# Altium schematic sheet STB_Camera.SchDoc: STB Light Board - Camera
size A3; Author: mayerph; DrawnBy: mayerph; Organization: PBL; Revision: A; SheetNumber: 12; SheetTotal: 21
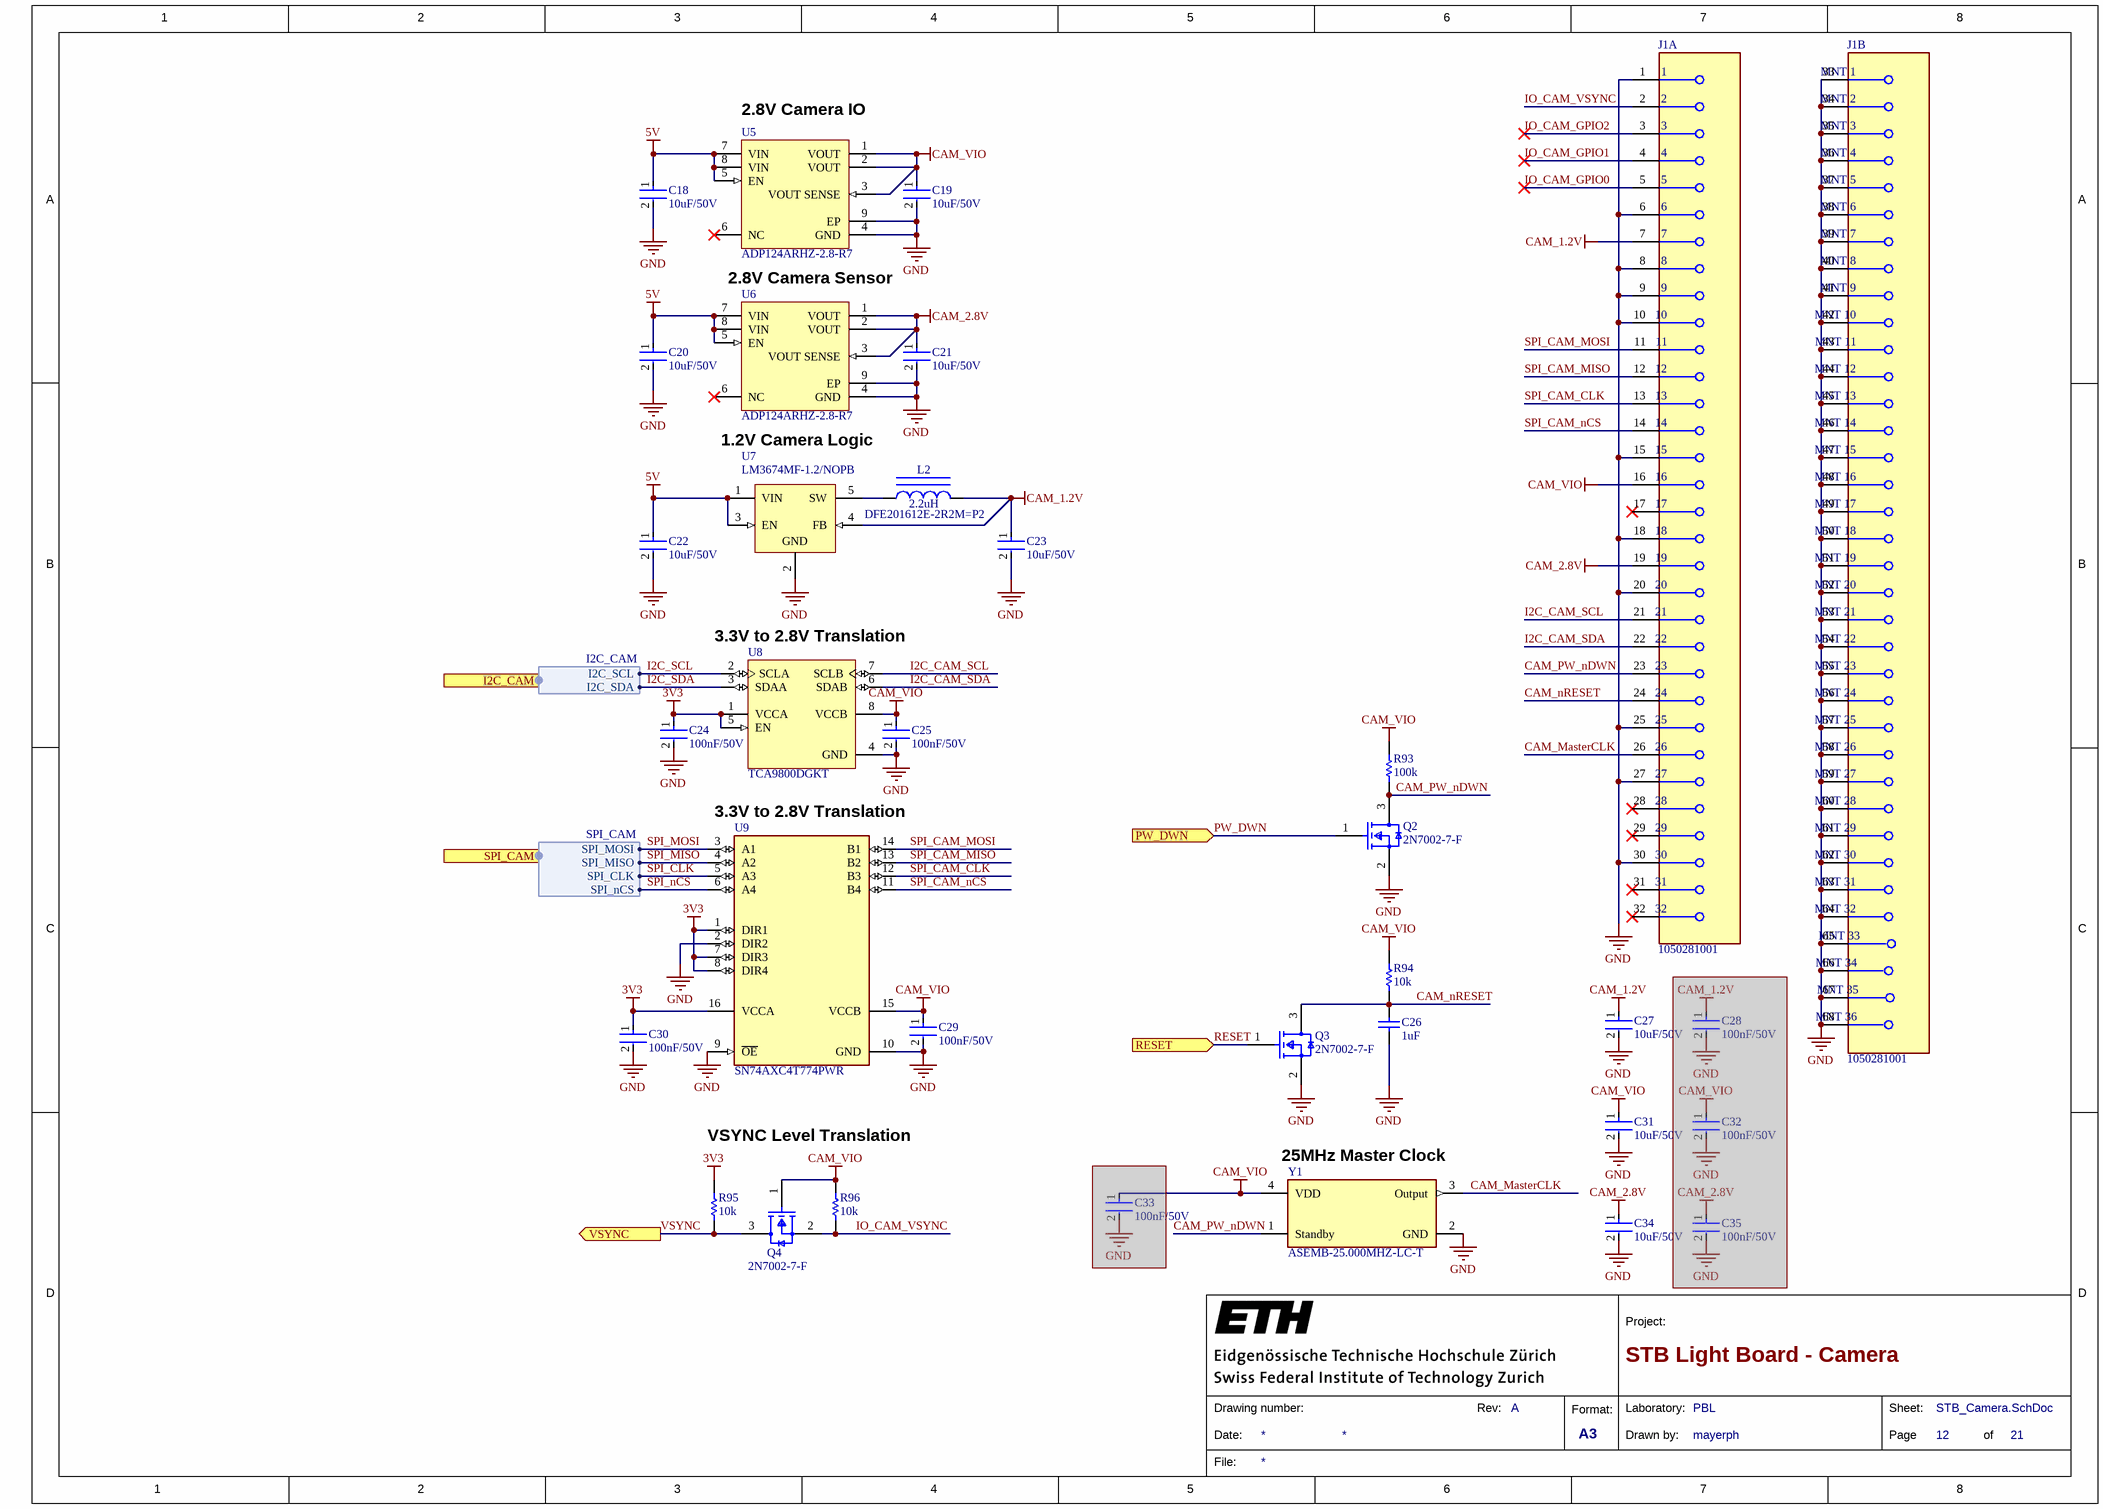
[diagram p0: STB_Camera.SchDoc]

## Parts
C18  10uF/50V  [FP-CL31B106KBHNNNE-MFG]
C19  10uF/50V  [FP-CL31B106KBHNNNE-MFG]
C20  10uF/50V  [FP-CL31B106KBHNNNE-MFG]
C21  10uF/50V  [FP-CL31B106KBHNNNE-MFG]
C22  10uF/50V  [FP-CL31B106KBHNNNE-MFG]
C23  10uF/50V  [FP-CL31B106KBHNNNE-MFG]
C24  100nF/50V  [FP-CL10-0_1-MFG]
C25  100nF/50V  [FP-CL10-0_1-MFG]
C26  1uF  [CAPC1608X90X35LL15T15]
C27  10uF/50V  [FP-CL31B106KBHNNNE-MFG]
C28  100nF/50V  [FP-CL10-0_1-MFG]  (masked out: inside a compile mask, not in the netlist)
C29  100nF/50V  [FP-CL10-0_1-MFG]
C30  100nF/50V  [FP-CL10-0_1-MFG]
C31  10uF/50V  [FP-CL31B106KBHNNNE-MFG]
C32  100nF/50V  [FP-CL10-0_1-MFG]  (masked out: inside a compile mask, not in the netlist)
C33  100nF/50V  [FP-CL10-0_1-MFG]  (masked out: inside a compile mask, not in the netlist)
C34  10uF/50V  [FP-CL31B106KBHNNNE-MFG]
C35  100nF/50V  [FP-CL10-0_1-MFG]  (masked out: inside a compile mask, not in the netlist)
J1  1050281001  [FP-1050281001-MFG]  (parts A,B of 2)
L2  DFE201612E-2R2M=P2  value 2.2uH  [INDC2016X10L]
Q2  2N7002-7-F  [FP-SOT23-MFG]
Q3  2N7002-7-F  [FP-SOT23-MFG]
Q4  2N7002-7-F  [FP-SOT23-MFG]
R93  100k  [RESC1005X40X25LL05T10]
R94  10k  [RESC1005X40X25LL05T05]
R95  10k  [RESC1005X40X25LL05T05]
R96  10k  [RESC1005X40X25LL05T05]
U5  ADP124ARHZ-2.8-R7  [ADI-RH-8-1_N]
U6  ADP124ARHZ-2.8-R7  [ADI-RH-8-1_N]
U7  LM3674MF-1.2/NOPB  [DBV0005A_N]
U8  TCA9800DGKT  [DGK0008A_L]
U9  SN74AXC4T774PWR  [FP-PW0016A-IPC_B]
Y1  ASEMB-25.000MHZ-LC-T  [FP-ASEMB-MFG]

## Ports
I2C_CAM (harness I2C_CAM, see STB_LightBoard[5A]), PW_DWN (in, see STB_LightBoard[5A]), RESET (in, see STB_LightBoard[5A]), SPI_CAM (harness SPI_CAM, see STB_LightBoard[5A]), VSYNC (out, see STB_LightBoard[5A])

## Harnesses
I2C_CAM: I2C_SDA, I2C_SCL
SPI_CAM: SPI_MISO, SPI_MOSI, SPI_CLK, SPI_nCS

## Nets
3V3: C24.1 C30.1 R95.1 U8.1(VCCA) U8.5(EN) U9.1(DIR1) U9.7(DIR3) U9.8(DIR4) U9.16(VCCA)
5V: C18.1 C20.1 C22.1 U5.5(EN) U5.7(VIN) U5.8(VIN) U6.5(EN) U6.7(VIN) U6.8(VIN) U7.1(VIN) U7.3(EN)
CAM_1.2V: C23.1 C27.1 J1.7 L2.2 U7.4(FB)
CAM_2.8V: C21.1 C34.1 J1.19 U6.1(VOUT) U6.2(VOUT) U6.3(VOUT_SENSE)
CAM_VIO: C19.1 C25.1 C29.1 C31.1 J1.16 Q4.1(G) R93.1 R94.1 R96.1 U5.1(VOUT) U5.2(VOUT) U5.3(VOUT_SENSE) U8.8(VCCB) U9.15(VCCB) Y1.4(VDD)
GND: C18.2 C19.2 C20.2 C21.2 C22.2 C23.2 C24.2 C25.2 C26.1 C27.2 C29.2 C30.2 C31.2 C34.2 J1.1 J1.6 J1.8 J1.9 J1.10 J1.15 J1.18 J1.20 J1.25 J1.27 J1.30 J1.33(MNT_1) J1.34(MNT_2) J1.35(MNT_3) J1.36(MNT_4) J1.37(MNT_5) J1.38(MNT_6) J1.39(MNT_7) J1.40(MNT_8) J1.41(MNT_9) J1.42(MNT_10) J1.43(MNT_11) J1.44(MNT_12) J1.45(MNT_13) J1.46(MNT_14) J1.47(MNT_15) J1.48(MNT_16) J1.49(MNT_17) J1.50(MNT_18) J1.51(MNT_19) J1.52(MNT_20) J1.53(MNT_21) J1.54(MNT_22) J1.55(MNT_23) J1.56(MNT_24) J1.57(MNT_25) J1.58(MNT_26) J1.59(MNT_27) J1.60(MNT_28) J1.61(MNT_29) J1.62(MNT_30) J1.63(MNT_31) J1.64(MNT_32) J1.65(MNT_33) J1.66(MNT_34) J1.67(MNT_35) J1.68(MNT_36) Q2.2(S) Q3.2(S) U5.4(GND) U5.9(EP) U6.4(GND) U6.9(EP) U7.2(GND) U8.4(GND) U9.2(DIR2) U9.9(~{OE}) U9.10(GND) Y1.2(GND)
CAM_MasterCLK: J1.26 Y1.3(Output)
CAM_nRESET: C26.2 J1.24 Q3.3(D) R94.2
CAM_PW_nDWN: J1.23 Q2.3(D) R93.2 Y1.1(Standby)
I2C_CAM_SCL: J1.21 U8.7(SCLB)
I2C_CAM_SDA: J1.22 U8.6(SDAB)
I2C_SCL: U8.2(SCLA) ; port I2C_CAM.I2C_SCL
I2C_SDA: U8.3(SDAA) ; port I2C_CAM.I2C_SDA
IO_CAM_GPIO0: J1.5
IO_CAM_GPIO1: J1.4
IO_CAM_GPIO2: J1.3
IO_CAM_VSYNC: J1.2 Q4.2(S) R96.2
PW_DWN: Q2.1(G) ; port PW_DWN
RESET: Q3.1(G) ; port RESET
SPI_CAM_CLK: J1.13 U9.12(B3)
SPI_CAM_MISO: J1.12 U9.13(B2)
SPI_CAM_MOSI: J1.11 U9.14(B1)
SPI_CAM_nCS: J1.14 U9.11(B4)
SPI_CLK: U9.5(A3) ; port SPI_CAM.SPI_CLK
SPI_MISO: U9.4(A2) ; port SPI_CAM.SPI_MISO
SPI_MOSI: U9.3(A1) ; port SPI_CAM.SPI_MOSI
SPI_nCS: U9.6(A4) ; port SPI_CAM.SPI_nCS
VSYNC: Q4.3(D) R95.2 ; port VSYNC
NetL2_1: L2.1 U7.5(SW)

Not connected (* = marked no-connect by the designer): J1 17* 28* 29* 31* 32*; U5 6(NC)*; U6 6(NC)*

## Notes on the sheet
- (near U5) 2.8V Camera IO
- 2.8V Camera Sensor
- 1.2V Camera Logic
- (near U8) 3.3V to 2.8V Translation
- (near U9) 3.3V to 2.8V Translation
- VSYNC Level Translation
- (near Y1) 25MHz Master Clock
- 1
- 2
- 3
- 4
- 5
- 6
- 7
- 8
- A
- B
- C
- D
- Project:
- Date:
- Drawing number:
- Rev:
- Format:
- A3
- Drawn by:
- Laboratory:
- Page
- Sheet:
- of
- File:

## Library data of the parts
C18-C23 C27 C31 C34 = CMP-2000-07530-2: CAP CER 10UF 50V X7R 1206; Manufacturer: Samsung; Manufacturer Part Number: CL31B106KBHNNNE; Tolerance: 10%; Material: Ceramic; Temperature Coefficient: 15%; Multilayer: Yes; Temperature Characteristic: X7R; Digikey Description: CAP CER 10UF 50V X7R 1206; Device Class L1: Passive Components; Value: 10uF; Lead Free: Yes; Device Class L3: Ceramic Capacitors; Octopart: https://octopart.com/cl31b106kbhnnne-samsung-30507377; ComponentLink2URL: http://www.samsungsem.com/global/front/downloadcms.do?path=%2F%2Fglobal%2F%2Fsupport%2F%2Fproduct-search%2F%2Fmlcc%2F%2F__icsFiles%2F%2Fafieldfile%2F%2F2019%2F%2F06%2F%2F18&fileName=CL31B106KBHNNNE-19.pdf; Voltage Rating: 50V; Temperature Range Low: -55°C; RoHS: TRUE; Temperature: -55°C to +125°C; Category: Cap; ComponentLink2Description: Datasheet; Automotive: No; Device Class L2: Capacitors; Capacitance: 10uF; Height: 1.8mm; Temperature Range High: +125°C; Package: CL31B106KBHNNNE; Supplier 1: Digi-Key; Supplier Part Number 1: 1276-6767-6-ND; Stock 1: 1900998; Pricing 1: 1=0.33000, 10=0.22700, 50=0.15920, 100=0.13650, 500=0.10236, 1000=0.08643 (USD); Mount: Surface Mount; Number of Pins: 2; Dielectric Material: Ceramic; Terminal Finish: Nickel; Size Code: 1206; Package Shape: Rectangular; Min Operating Temperature: -55°C; Max Operating Temperature: 125°C; Capacitor Type: Ceramic; Negative Tolerance: 10%; Positive Tolerance: 10%; Rated DC Voltage (URdc): 50V; Termination: Wraparound; Package Style: SMTMeter; Packaging: Tape and Reel; JESD-609 Code: e3; Temperature Characteristics Code: X7R; Length: 3.2mm; Width: 1.6mm; REACH SVHC: Yes; RoHS Compliant: Yes; ComponentLink1URL: https://datasheet.ciiva.com:443/pdfs/VipMasterIC/IC/SEMS/SEMS-S-A0008524842/SEMS-S-A0008524770-1.pdf?src-supplier=IHS+Markit; ComponentLink1Description: https://datasheet.ciiva.com:443/pdfs/VipMasterIC/IC/SEMS/SEMS-S-A0008524842/SEMS-S-A0008524770-1.pdf?src-supplier=IHS+Markit; ComponentLink3URL: http://www.samsungsem.com/kr/support/product-search/mlcc/CL31B106KBHNNNE.jsp?src-supplier=Digi-Key; ComponentLink3Description: http://www.samsungsem.com/kr/support/product-search/mlcc/CL31B106KBHNNNE.jsp?src-supplier=Digi-Key
C24 C25 C28-C30 C32 C33 C35 = CMP-13271-000011-1: CAP CER 0.1UF 50V X7R 0603; Manufacturer: Samsung Electro-Mechanics America, Inc; Manufacturer Part Number: CL10B104JB8NNNC; Value: 100nF; Material: Ceramic; Temperature Coefficient: 15%; Tolerance: 5%; Multilayer: Yes; Ipc Land Pattern Name: CAPC16080X80; Device Class L1: Passive Components; Digikey Description: CAP CER 0.1UF 50V X7R 0603; Voltage Rating: 50V; Height: 0.9mm; ComponentLink2Description: Datasheet; Device Class L2: Capacitors; ComponentLink2URL: http://www.samsungsem.com/kr/support/product-search/mlcc/__icsFiles/afieldfile/2019/06/18/CL10B104JB8NNNC-19.pdf; Temperature Characteristic: X7R; Temperature Range High: +125°C; Lead Free: Yes; Temperature Range Low: -55°C; Category: Cap; Package: CL10-0.1; Temperature: -55°C to +125°C; Octopart: https://octopart.com/cl10b104jb8nnnc-samsung-9302151; Device Class L3: Ceramic Capacitors; RoHS: TRUE; Automotive: No; Capacitance: 100nF; Supplier 1: Digi-Key; Supplier Part Number 1: 1276-1033-1-ND; Stock 1: 1084419; Pricing 1: 1=0.10000, 10=0.03900, 50=0.02120, 100=0.01740, 500=0.01240, 1000=0.00975 (USD); Mount: Surface Mount; Number of Pins: 2; Dielectric Material: Ceramic; Package Shape: Rectangular; Size Code: 0603; Terminal Finish: Nickel; Min Operating Temperature: -55°C; Max Operating Temperature: 125°C; JESD-609 Code: e3; Capacitor Type: Ceramic; Negative Tolerance: 5%; Package Style: SMTMeter; Packaging: Tape and Reel; Positive Tolerance: 5%; Rated DC Voltage (URdc): 50V; Temperature Characteristics Code: X7R; Termination: Wraparound; Length: 1.6mm; Width: 0.8mm; REACH SVHC: Yes; RoHS Compliant: Yes; ComponentLink1URL: https://datasheet.ciiva.com:443/pdfs/VipMasterIC/IC/SEMS/SEMS-S-A0008384515/SEMS-S-A0008873313-1.pdf?src-supplier=IHS+Markit; ComponentLink1Description: https://datasheet.ciiva.com:443/pdfs/VipMasterIC/IC/SEMS/SEMS-S-A0008384515/SEMS-S-A0008873313-1.pdf?src-supplier=IHS+Markit; ComponentLink3URL: https://datasheet.ciiva.com/25793/cl10b104jb8nnnc-25793394.pdf?src-supplier=Digi-Key; ComponentLink3Description: https://datasheet.ciiva.com/25793/cl10b104jb8nnnc-25793394.pdf?src-supplier=Digi-Key; ComponentLink4URL: https://datasheet.ciiva.com/16498/cl10b104jb8nnnc-16498485.pdf?src-supplier=Future+Electronics; ComponentLink4Description: https://datasheet.ciiva.com/16498/cl10b104jb8nnnc-16498485.pdf?src-supplier=Future+Electronics; ComponentLink5URL: https://datasheet.ciiva.com/26838/getdatasheetpartid-359321-26838402.pdf?src-supplier=Verical; ComponentLink5Description: https://datasheet.ciiva.com/26838/getdatasheetpartid-359321-26838402.pdf?src-supplier=Verical; ComponentLink6URL: https://datasheet.ciiva.com/29199/456613-da-01-en-vs-kondensator-0603-29199008.pdf?src-supplier=Conrad; ComponentLink6Description: https://datasheet.ciiva.com/29199/456613-da-01-en-vs-kondensator-0603-29199008.pdf?src-supplier=Conrad
C26 = CMP-2006-02298-2: Manufacturer: Kemet; Part Number: C0603C105K4RACTU; Dielectric Material: Ceramic; Multilayer: Yes; Negative Tolerance: 10%; Rated DC Voltage (URdc): 16V; Temperature Characteristics Code: X7R; Supplier 1: Digi-Key; Supplier Part Number 1: 399-C0603C105K4RAC7867DKR-ND; Manufacturer Part Number: C0603C105K4RACTU; RoHS: Yes; Category: Ceramic Capacitors; Stock 1: 1549593; Pricing 1: 1=0.10000, 10=0.07700, 50=0.04180, 100=0.03410, 500=0.02440, 1000=0.01916 (USD); Mount: Surface Mount; Number of Pins: 2; Package Shape: Rectangular; Size Code: 0603; Terminal Finish: Nickel; Min Operating Temperature: -55°C; Max Operating Temperature: 125°C; Value: 1uF; Capacitor Type: Ceramic; Packaging: Tape and Reel; Positive Tolerance: 10%; Termination: Wraparound; JESD-609 Code: e3; Package Style: SMTMeter; Length: 1.6mm; Width: 0.8mm; Height: 0.8mm; REACH SVHC: Yes; RoHS Compliant: Yes; ComponentLink1URL: https://datasheet.ciiva.com:443/pdfs/VipMasterIC/IC/KEME/KEME-S-A0008991654/KEME-S-A0008991654-1.pdf?src-supplier=IHS+Markit; ComponentLink1Description: https://datasheet.ciiva.com:443/pdfs/VipMasterIC/IC/KEME/KEME-S-A0008991654/KEME-S-A0008991654-1.pdf?src-supplier=IHS+Markit
J1 = CMP-04777-000001-1: CONN CAM SOCKET 32POS GOLD; Manufacturer: Molex; Voltage Rating: 50V; Pitch: 0.9mm; Conn Orientation: Top View; Conn Gender: Female; Is Female: yes; Number Of Contacts: 32; Current Rating: 0.5A; Temperature Range High: +85°C; Lead Free: Yes; Digikey Description: CONN CAM SOCKET 32POS GOLD; Octopart: https://octopart.com/105028-1001-molex-19914268; Device Class L2: IC and Component Sockets; Device Class L3: unset; Temperature Range Low: -55°C; Manufacturer Part Number: 1050281001; Height: 4.35mm; Automotive: No; Temperature: -55°C to +85°C; Device Class L1: Connectors; Category: Conn; ComponentLink2Description: Datasheet; ComponentLink2URL: https://www.molex.com/pdm_docs/sd/1050281001_sd.pdf; Package: 0; Contact Material: Gold; RoHS: TRUE
L2 = CMP-01651-1: 2.2µH Shielded Wirewound Inductor 1.8A 116mOhm Max 0806 (2016 Metric); Manufacturer: Murata Electronics; Inductance: 2,2µH; Current Rating (Amps): 1,8A; Tolerance: ±20%; Material - Core: Metal; Current - Saturation: 2.4A; Inductance Frequency - Test: 1MHz; DC Resistance (DCR): 116mOhm Max; Ratings: -; Series: DFE201612E; Operating Temperature: -40°C ~ 125°C; Features: -; Package / Case: 0806 (2016 Metric); Q @ Freq: -; Packaging: Tape & Reel (TR); Mounting Type: Surface Mount; Frequency - Self Resonant: -; Part Status: Active; Shielding: Shielded; Type: Wirewound; Supplier Device Package: 0806; Manufacturer Part Number: DFE201612E-2R2M=P2
Q2-Q4 = CMP-2000-04929-2: MOSFET N-CH 60V 115MA SOT23-3; Manufacturer: Diodes; Turn-On Delay Time: 7ns; Turn-Off Delay Time: 11ns; Drain to Source Resistance: 7.5R; Rise Time: 3ns; Drain to Source Breakdown Voltage: 70V; Input Capacitance: 50pF; Number of Elements: 1; Power Dissipation: 540mW; Max Power Dissipation: 300mW; Fall Time: 5.6ns; Gate to Source Voltage (Vgs): 20V; Threshold Voltage: 2.5V; Element Configuration: Single; Package Body Material: Plastic; Transistor Element Material: SILICON; Polarity/Channel Type: N-CHANNEL; Drain-source On Resistance-Max: 13.5R; FET Technology: METAL-OXIDE SEMICONDUCTOR; Operating Mode: ENHANCEMENT MODE; Transistor Application: SWITCHING; Feedback Cap-Max (Crss): 5pF; Time @ Peak Reflow Temperature-Max (s): 40s; Qualification Status: Not Qualified; Termination: SMD/SMT; Weight: 0.000282oz; Radiation Hardening: No; Max Operating Temperature: 150°C; On-State Resistance: 7.5R; Mount: Surface Mount; Current Rating: 115mA; Contact Plating: Tin; Lead Free: Lead Free; Min Operating Temperature: -55°C; Number of Pins: 3; REACH SVHC: No SVHC; Drain to Source Voltage (Vdss): 60V; Width: 1.3mm; Package Quantity: 3000; Length: 2.9mm; Case/Package: SOT-23; Number of Channels: 1; Dual Supply Voltage: 60V; Packaging: Tape and Reel; Height: 1mm; Voltage Rating (DC): 60V; Nominal Vgs: 2.5V; Continuous Drain Current (ID): 115mA; Voltage: 60V; Rds On Max: 7.5R; Supplier 1: Digi-Key; Supplier Part Number 1: 2N7002-FDIDKR-ND; Manufacturer Part Number: 2N7002-7-F; RoHS: Yes; Category: MOSFETs; Stock 1: 2221303; Pricing 1: 1=0.21000, 10=0.19500, 100=0.10620, 500=0.06534, 1000=0.04455 (USD); Package Shape: Rectangular; Terminal Finish: Tin; Moisture Sensitivity Level: 1; Drain Current-Max (Abs) (ID): 115mA; Drain Current-Max (ID): 115mA; DS Breakdown Voltage-Min: 60V; JESD-30 Code: R-PDSO-G3; Package Style: SMALL OUTLINEMeter; Power Dissipation-Max (Abs): 300mW; Surface Mount: Yes; Terminal Form: Gull Wing; Terminal Position: DUAL; JESD-609 Code: e3; Peak Reflow Temperature (Cel): 260°C; Reach SVHC Compliant: Yes; RoHS Compliant: Yes; ComponentLink1URL: https://datasheet.ciiva.com:443/pdfs/VipMasterIC/IC/DIOD/DIOD-S-A0009689736/DIOD-S-A0009691859-1.pdf?src-supplier=IHS+Markit; ComponentLink1Description: https://datasheet.ciiva.com:443/pdfs/VipMasterIC/IC/DIOD/DIOD-S-A0009689736/DIOD-S-A0009691859-1.pdf?src-supplier=IHS+Markit
R93 = CMP-2002-07343-1: Part Number: RC0402FR-07100KL; Manufacturer: Yageo / Phycomp; Tolerance: 1%; Rated Power Dissipation (P): 62.5mW; Rated Temperature: 70°C; Value: 100 kOhm; Temperature Coefficient: 100ppm/°C; Working Voltage: 50V; Additional Feature: LASER TRIMMABLE; Package Height: 0.35mm; Package Length: 1mm; Package Width: 0.5mm; Supplier 1: Digi-Key; Supplier Part Number 1: 311-100KLRDKR-ND; Manufacturer Part Number: RC0402FR-07100KL; RoHS: Yes; Category: Chip SMD Resistors; Stock 1: 43269933; Pricing 1: 1=0.10000, 10=0.01500, 100=0.00600, 1000=0.00267, 2500=0.00232, 5000=0.00192 (USD); Mount: Surface Mount; Number of Pins: 2; Size Code: 0402; Terminal Finish: Nickel; Package Shape: Rectangular; Min Operating Temperature: -55°C; Max Operating Temperature: 155°C; Resistor Type: FIXED RESISTOR; Technology: METAL GLAZE/THICK FILM; Termination: Wraparound; JESD-609 Code: e3; Construction: Chip; Package Style: SMTMeter; Packaging: Tape and Reel; REACH SVHC: Yes; RoHS Compliant: Yes; ComponentLink1URL: https://datasheet.ciiva.com:443/pdfs/VipMasterIC/IC/YAGO/YAGO-S-A0008145938/YAGO-S-A0008145938-1.pdf?src-supplier=IHS+Markit; ComponentLink1Description: https://datasheet.ciiva.com:443/pdfs/VipMasterIC/IC/YAGO/YAGO-S-A0008145938/YAGO-S-A0008145938-1.pdf?src-supplier=IHS+Markit
R94-R96 = CMP-2000-07588-1: Chip Resistor, 10 KOhm, +/- 1%, 0.1 W, -55 to 155 degC, 0402 (1005 Metric), RoHS, Tape and Reel; Manufacturer: Panasonic; Manufacturer Part Number: ERJ-2RKF1002X; Power Rating: 100mW; Voltage Rating: 50V; Value: 10 kOhm; Case\/Package: 0402; Temperature Coefficient: 100ppm\/degreesC; Rated Temperature: 70°C; Package Height: 0.35mm; Package Length: 1mm; Package Width: 0.5mm; Reference Standard: AEC-Q200; RoHSCompliant: True; Lead Free: LeadFree; Package Quantity: 1; Contact Plating: Tin; Length: 1mm; Radiation Hardening: No; REACH SVHC: NoSVHC; Max Operating Temperature: 155degC; Depth: 0.5mm; Case Code (Imperial): 0402; Military Standard: Not; Package Description: 2-Pin Surface Mount Device, Body 1 x 0.5 mm; Termination: SMD/SMT; Case Code (Metric): 1005; Height: 0.35mm; Packaging: TapeandReel; Voltage Rating (DC): 50V; Package Reference: 402; Number of Pins: 2; Tolerance: 1%; Mounting Technology: SurfaceMount; Width: 0.02inch; Mount: SurfaceMount; Datasheet URL: https://industrial.panasonic.com/cdbs/www-data/pdf/RDA0000/AOA0000C304.pdf; Composition: ThickFilm; Datasheet Version: 02/2017; Manufacturer URL: http://www.panasonic.com/; Max Power Dissipation: 100mW; Number of Terminations: 2; Min Operating Temperature: -55degC; Supplier 1: Digi-Key; Supplier Part Number 1: P10.0KLDKR-ND; RoHS: Yes; Category: Chip SMD Resistors; Stock 1: 108; Pricing 1: 1=0.10000, 10=0.03300, 100=0.01330, 1000=0.00599, 2500=0.00520, 5000=0.00429 (USD); Size Code: 0402; Terminal Finish: Nickel; Package Shape: Rectangular; Resistor Type: FIXED RESISTOR; Rated Power Dissipation (P): 100mW; Technology: METAL GLAZE/THICK FILM; Working Voltage: 50V; Construction: Rectangular; Package Style: SMTMeter; JESD-609 Code: e3; RoHS Compliant: Yes; ComponentLink1URL: https://datasheet.ciiva.com:443/pdfs/VipMasterIC/IC/PANA/PANA-S-A0009889626/PANA-S-A0009889626-1.pdf?src-supplier=IHS+Markit; ComponentLink1Description: https://datasheet.ciiva.com:443/pdfs/VipMasterIC/IC/PANA/PANA-S-A0009889626/PANA-S-A0009889626-1.pdf?src-supplier=IHS+Markit; ComponentLink2URL: https://datasheet.ciiva.com/11821/0900766b80f80784-11821171.pdf?src-supplier=RSComponents; ComponentLink2Description: https://datasheet.ciiva.com/11821/0900766b80f80784-11821171.pdf?src-supplier=RSComponents; ComponentLink3URL: https://datasheet.ciiva.com/27055/1987020-27055643.pdf?src-supplier=Jameco; ComponentLink3Description: https://datasheet.ciiva.com/27055/1987020-27055643.pdf?src-supplier=Jameco; ComponentLink4URL: https://datasheet.ciiva.com/43467/1678782-43467402.pdf?src-supplier=Farnell; ComponentLink4Description: https://datasheet.ciiva.com/43467/1678782-43467402.pdf?src-supplier=Farnell; ComponentLink5URL: https://datasheet.ciiva.com/28514/1678782-28514185.pdf?src-supplier=Element14; ComponentLink5Description: https://datasheet.ciiva.com/28514/1678782-28514185.pdf?src-supplier=Element14; ComponentLink6URL: https://datasheet.ciiva.com/24023/aoa0000ce2-24023017.pdf?src-supplier=Mouser; ComponentLink6Description: https://datasheet.ciiva.com/24023/aoa0000ce2-24023017.pdf?src-supplier=Mouser; ComponentLink7URL: https://datasheet.ciiva.com/16782/70260748-16782590.pdf?src-supplier=Allied+Electronics; ComponentLink7Description: https://datasheet.ciiva.com/16782/70260748-16782590.pdf?src-supplier=Allied+Electronics; ComponentLink8URL: https://datasheet.ciiva.com/16786/70260748-16786734.pdf?src-supplier=Allied+Electronics; ComponentLink8Description: https://datasheet.ciiva.com/16786/70260748-16786734.pdf?src-supplier=Allied+Electronics; ComponentLink9URL: https://datasheet.ciiva.com/9194/aoa0000ce2-9194142.pdf?src-supplier=Avnet; ComponentLink9Description: https://datasheet.ciiva.com/9194/aoa0000ce2-9194142.pdf?src-supplier=Avnet; ComponentLink10URL: https://datasheet.ciiva.com/16199/aoa0000ce2-16199478.pdf?src-supplier=Future+Electronics; ComponentLink10Description: https://datasheet.ciiva.com/16199/aoa0000ce2-16199478.pdf?src-supplier=Future+Electronics; ComponentLink11URL: https://datasheet.ciiva.com/48531/aoa0000ce2-48531069.pdf?src-supplier=Avnet; ComponentLink11Description: https://datasheet.ciiva.com/48531/aoa0000ce2-48531069.pdf?src-supplier=Avnet; ComponentLink12URL: https://datasheet.ciiva.com/30201/aoa0000ce2-30201022.pdf?src-supplier=Onlinecomponents.com; ComponentLink12Description: https://datasheet.ciiva.com/30201/aoa0000ce2-30201022.pdf?src-supplier=Onlinecomponents.com
U5 U6 = CMP-0786-00232-1: 500 mA, Low Quiescent Current, CMOS Linear Regulator, 2.3 to 5.5 V Vin, 2.8 V Vout, Industrial, 8-pin SOP (RH-8-1), Reel; Manufacturer: Analog Devices; Vin (min) (V): 2.3; Preset Vout Values (V): 2.8; Vin (max) (V): 5.5; Iout max: 500mA; Supply Current IGND @ Small Load: 45uA; Description: Fixed Positive LDO Regulator, 2.8V, 0.23V Dropout, CMOS, PDSO8; Package Body Material: Plastic; Adjustability: FIXED; Dropout Voltage1-Max: 230mV; Dropout Voltage1-Nom: 130mV; Input Voltage Absolute-Max: 6.5V; Max Input Voltage: 5.5V; Min Input Voltage: 2.3V; Line Regulation-Max: 0.0045%; Load Regulation-Max: 0.0139%; Number of Functions: 1; Output Voltage1-Max: 2.842V; Output Voltage1-Min: 2.744V; Output Voltage1-Nom: 2.8V; Package Equivalence Code: TSSOP8,.19; Regulator Type: FIXED POSITIVE SINGLE OUTPUT LDO REGULATOR; Time @ Peak Reflow Temperature-Max (s): 30s; Voltage Tolerance-Max: 1.5%; Qualification Status: Not Qualified; ComponentLink3Description: Package Specification; ComponentLink2Description: Datasheet; PackageDescription: 8-Pin Mini Small Outline Package, Body 3 x 3 mm, Pitch 0.65 mm; PackageVersion: 071008-A, 08/2008; PackageReference: RH-8-1; Packing: Reel; ComponentLink4Description: URL Link1; ComponentLink1URL: http://www.analog.com/en/index.html; DatasheetVersion: Rev. C; Mounting Technology: Surface Mount; ComponentLink4URL: Product URL:http://www.analog.com/en/ADP124/productSearch.html; PartNumber: ADP124ARHZ-2.8-R7; Code_JEDEC: MO-187-AA-T; ComponentLink2URL: http://www.analog.com/static/imported-files/data_sheets/ADP124_125.pdf; ComponentLink3URL: http://www.analog.com/static/imported-files/packages/PKG_PDF/MSOP_ED(RH)/RH_8_1.pdf; ComponentLink1Description: Manufacturer URL; Supplier 1: Digi-Key; Supplier Part Number 1: ADP124ARHZ-2.8-R7DKR-ND; Manufacturer Part Number: ADP124ARHZ-2.8-R7; RoHS: Yes; Category: Voltage Regulators - Linear; Stock 1: 960; Pricing 1: 1=2.01000 (USD); Package Code: HTSSOP; Number of Pins: 8; Package Shape: Square; Terminal Finish: Tin; JESD-609 Code: e3; JESD-30 Code: S-PDSO-G8; Moisture Sensitivity Level: 3; Number of Outputs: 1; Operating Temperature, TJ-Max: 125°C; Operating Temperature, TJ-Min: -40°C; Output Current1-Max: 500mA; Package Style: SMALL OUTLINE, HEAT SINK/SLUG, THIN PROFILE, SHRINK PITCHMeter; Packaging: Tape and Reel; Peak Reflow Temperature (Cel): 260°C; Surface Mount: Yes; Technology: CMOS; Terminal Form: Gull Wing; Terminal Position: DUAL; Length: 3mm; Width: 3mm; Height - Seated (Max): 1.1mm; Terminal Pitch: 0.65mm; Reach SVHC Compliant: Yes; RoHS Compliant: Yes; ComponentLink5URL: https://datasheet.ciiva.com:443/pdfs/VipMasterIC/IC/ANDI/ANDI-S-A0000447850/ANDI-S-A0000447850-1.pdf?src-supplier=IHS+Markit; ComponentLink5Description: https://datasheet.ciiva.com:443/pdfs/VipMasterIC/IC/ANDI/ANDI-S-A0000447850/ANDI-S-A0000447850-1.pdf?src-supplier=IHS+Markit; ComponentLink6URL: https://datasheet.ciiva.com/2050/adp124-125-2050438.pdf?src-supplier=Digi-Key; ComponentLink6Description: https://datasheet.ciiva.com/2050/adp124-125-2050438.pdf?src-supplier=Digi-Key; ComponentLink7URL: https://datasheet.ciiva.com/2050/adp124-125-2050439.pdf?src-supplier=Digi-Key; ComponentLink7Description: https://datasheet.ciiva.com/2050/adp124-125-2050439.pdf?src-supplier=Digi-Key; ComponentLink8URL: https://datasheet.ciiva.com/8242/adp124-125-8242133.pdf?src-supplier=Avnet; ComponentLink8Description: https://datasheet.ciiva.com/8242/adp124-125-8242133.pdf?src-supplier=Avnet; ComponentLink9URL: https://datasheet.ciiva.com/2050/adp124-125-2050440.pdf?src-supplier=Digi-Key; ComponentLink9Description: https://datasheet.ciiva.com/2050/adp124-125-2050440.pdf?src-supplier=Digi-Key
U7 = CMP-0063-01102-3: 2MHz, 600mA Step-Down DC-DC Converter, 5-pin SOT-23, Pb-Free; Manufacturer: Texas Instruments; CompType: MiscPower; PackageTopMarking: SLRB*XTT; PowerWise: Y; Package Body Material: Plastic; Analog IC - Other Type: SWITCHING REGULATOR; Control Mode: VOLTAGE-MODE; Control Technique: PULSE WIDTH MODULATION; Max Input Voltage: 5.5V; Min Input Voltage: 2.7V; Nominal Input Voltage: 3.6V; Number of Functions: 1; Max Output Current: 1.2A; Package Equivalence Code: TSOP5/6,.11,37; Switcher Configuration: BUCK; Switching Frequency-Max: 2.6MHz; Time @ Peak Reflow Temperature-Max (s): 40s; Qualification Status: Not Qualified; PackageReference: DBV0005A; PackageDescription: Molded SOT-23, .115 x .063 x .040 in Body, 5 Lead, .0375 in Pitch; ComponentLink1Description: Datasheet URL; PinCount: 5; ComponentLink1URL: http://www.ti.com/general/docs/lit/getliterature.tsp?genericPartNumber=LM3674&fileType=pdf; RoHS: Y; Supplier 1: Digi-Key; Supplier Part Number 1: LM3674MF-1.2/NOPBDKR-ND; Manufacturer Part Number: LM3674MF-1.2/NOPB; Category: Voltage Regulators - Switching; Stock 1: 3010; Pricing 1: 1=1.74000, 10=1.56500, 25=1.47600, 100=1.25760, 250=1.18084, 500=1.03324 (USD); Package Code: LSSOP; Number of Pins: 5; Package Shape: Rectangular; Terminal Finish: Tin; Min Operating Temperature: -30°C; Max Operating Temperature: 85°C; JESD-609 Code: e3; JESD-30 Code: R-PDSO-G5; Moisture Sensitivity Level: 1; Package Style: SMALL OUTLINE, LOW PROFILE, SHRINK PITCHMeter; Peak Reflow Temperature (Cel): 260°C; Surface Mount: Yes; Terminal Form: Gull Wing; Terminal Position: DUAL; Length: 2.92mm; Width: 1.6mm; Height - Seated (Max): 1.22mm; Terminal Pitch: 0.953mm; Temperature Grade: OTHER; Reach SVHC Compliant: Yes; RoHS Compliant: Yes; ComponentLink2URL: https://datasheet.ciiva.com:443/pdfs/VipMasterIC/IC/NATL/NATLS08395/NATLS08395-1.pdf?src-supplier=IHS+Markit; ComponentLink2Description: https://datasheet.ciiva.com:443/pdfs/VipMasterIC/IC/NATL/NATLS08395/NATLS08395-1.pdf?src-supplier=IHS+Markit; ComponentLink3URL: https://datasheet.ciiva.com/15113/getdatasheetpartid-143703-15113141.pdf?src-supplier=Verical; ComponentLink3Description: https://datasheet.ciiva.com/15113/getdatasheetpartid-143703-15113141.pdf?src-supplier=Verical; ComponentLink4URL: https://datasheet.ciiva.com/3220/lm3674-3220103.pdf?src-supplier=Avnet; ComponentLink4Description: https://datasheet.ciiva.com/3220/lm3674-3220103.pdf?src-supplier=Avnet; ComponentLink5URL: https://datasheet.ciiva.com/28652/1882991-28652506.pdf?src-supplier=Element14; ComponentLink5Description: https://datasheet.ciiva.com/28652/1882991-28652506.pdf?src-supplier=Element14; ComponentLink6URL: https://datasheet.ciiva.com/6594/lm3674-6594229.pdf?src-supplier=Digi-Key; ComponentLink6Description: https://datasheet.ciiva.com/6594/lm3674-6594229.pdf?src-supplier=Digi-Key
U8 = CMP-01310-1: Level-Translating I2C Bus Buffer/Repeater 2-Channel Bi-Directional 0.8V to 3.6V 8-Pin VSSOP T/R; Manufacturer: Texas Instruments; Channel Type: Bidirectional; Number of Outputs: 2; Number of Circuits: 1; Case/Package: VSSOP; Max Operating Temperature: 85°C; Mount: Surface Mount; Packaging: Cut Tape; Min Operating Temperature: -40°C; Supplier 1: Digi-Key; Supplier Part Number 1: 296-47439-1-ND; Manufacturer Part Number: TCA9800DGKT; RoHS: No; Category: Integrated Circuits (ICs); Stock 1: 4011; Pricing 1: 1=0.95000, 10=0.85000, 25=0.80640, 100=0.61920 (USD); ComponentLink1URL: http://www.ti.com/lit/ds/symlink/tca9800.pdf?src-supplier=Digi-Key; ComponentLink1Description: http://www.ti.com/lit/ds/symlink/tca9800.pdf?src-supplier=Digi-Key
U9 = CMP-04899-000065-1: Bus Transceiver, AXC Series, 1-Func, 4-Bit, True Output, CMOS, PDSO16; Manufacturer: Texas Instruments; Supplier 1: Digi-Key; Supplier Part Number 1: 296-SN74AXC4T774PWRDKR-ND; Manufacturer Part Number: SN74AXC4T774PWR; RoHS: Yes; Category: Voltage Level Shifters; Stock 1: 4850; Pricing 1: 1=1.36000, 10=1.21300, 25=1.15160, 100=0.94590, 250=0.88424, 500=0.78144, 1000=0.62080 (USD); ComponentLink1URL: https://www.ti.com:443/lit/ds/symlink/sn74axc4t774.pdf?src-supplier=IHS+Markit; ComponentLink1Description: https://www.ti.com:443/lit/ds/symlink/sn74axc4t774.pdf?src-supplier=IHS+Markit
Y1 = CMP-27762-000017-1: MEMS OSC XO 25.0000MHZ CMOS SMD; Manufacturer: Abracon; Load Capacitance: 15pF; Min Supply Voltage: 1.8V; Max Supply Current: 15mA; Stability: 50ppm; Frequency: 25MHz; Max Junction Temp: +150°C; Max Supply Voltage: 3.3V; Package Body Material: Plastic; Operating Frequency-Max: 150kHz; Operating Frequency-Min: 1kHz; Operating Frequency-Nom: 250; Power Supplies: 1.8/3.3V; Qualification Status: Not Qualified; Category: Crys; Package: ASEMB; Series: ASEMB; Footprint Url: https://abracon.com/Support/PackageDrawing/Oscillators/ASEMB.PDF; ComponentLink2URL: https://abracon.com/Oscillators/ASEMB.pdf; Temperature Range Low: -40°C; Device Class L1: Passive Components; Device Class L3: Oscillators; ComponentLink2Description: Datasheet; RoHS: TRUE; Automotive: No; Mouser Description: Standard Clock Oscillators 25.000MHZ 50ppm -40 + 85C; Device Class L2: Crystals / Oscillators; Manufacturer Part Number: ASEMB-25.000MHZ-LC-T; Temperature Range High: +85°C; Temperature: -40°C to +85°C; Lead Free: Yes; Octopart: https://octopart.com/asemb-25.000mhz-lc-t-abracon-21704580; Digikey Description: MEMS OSC XO 25.0000MHZ CMOS SMD; Height: 0.9mm; Supplier 1: Digi-Key; Supplier Part Number 1: 535-11750-6-ND; Stock 1: 1318; Pricing 1: 1=2.48000, 10=2.41800, 50=2.30280, 100=2.01500, 500=1.95738 (USD); Mount: Surface Mount; Number of Pins: 4; Terminal Finish: Nickel; Min Operating Temperature: -40°C; Max Operating Temperature: 85°C; JESD-609 Code: e4; Technology: CMOS; Reach SVHC Compliant: Yes; RoHS Compliant: Yes; ComponentLink1URL: https://datasheet.ciiva.com:443/pdfs/VipMasterIC/IC/ABRC/ABRCS03128/ABRCS03128-1.pdf?src-supplier=IHS+Markit; ComponentLink1Description: https://datasheet.ciiva.com:443/pdfs/VipMasterIC/IC/ABRC/ABRCS03128/ABRCS03128-1.pdf?src-supplier=IHS+Markit; ComponentLink3URL: https://datasheet.ciiva.com/868/asemb-868320.pdf?src-supplier=Digi-Key; ComponentLink3Description: https://datasheet.ciiva.com/868/asemb-868320.pdf?src-supplier=Digi-Key; ComponentLink4URL: https://datasheet.ciiva.com/868/asemb-868318.pdf?src-supplier=Digi-Key; ComponentLink4Description: https://datasheet.ciiva.com/868/asemb-868318.pdf?src-supplier=Digi-Key; ComponentLink5URL: https://datasheet.ciiva.com/868/asemb-868319.pdf?src-supplier=Digi-Key; ComponentLink5Description: https://datasheet.ciiva.com/868/asemb-868319.pdf?src-supplier=Digi-Key